# Altium schematic sheet 2228_Recepteur_Alimentation.SchDoc
size A4; Author: Miguel Santos; Organization: ETML-ES; Address1: Avenue Recordon 1; Address2: 1004 Lausanne; Address3: Switzerland; Revision: B; SheetNumber: 1; SheetTotal: 3; Version: 1.0
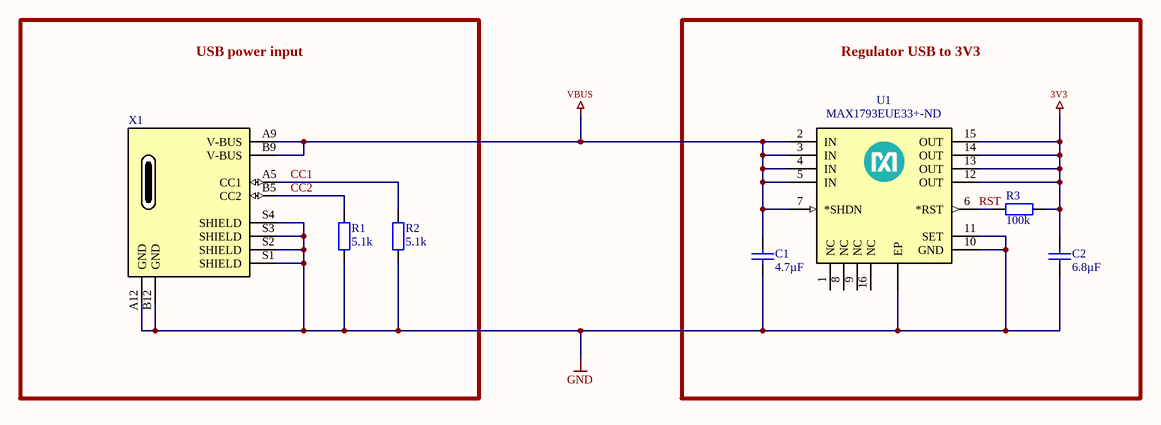
[diagram p0: 2228_Recepteur_Alimentation.SchDoc]

## Parts
C1  value 4.7µF  [CAP_0805]  (hidden comment: CAP_SMD)
C2  value 6.8µF  [CAP_0805]  (hidden comment: CAP_SMD)
R1  value 5.1k  [RES_0805]  (hidden comment: RES_SMD)
R2  value 5.1k  [RES_0805]  (hidden comment: RES_SMD)
R3  value 100k  [RES_0805]  (hidden comment: RES_SMD)
U1  Supplier Part Number 1: MAX1793EUE33+-ND  [SOP65P638X110-17N]  (hidden comment: MAX1793EUE33+)
X1  UJC-HP-3-SMT-TR  [CUI_UJC-HP-3-SMT-TR]  (value not drawn)

## Blocks framed on the sheet
USB power input: R1 R2 X1
Regulator USB to 3V3: C1 C2 R3 U1

## Nets
3V3: C2.2 R3.2 U1.12(OUT) U1.13(OUT) U1.14(OUT) U1.15(OUT)
GND: C1.1 C2.1 R1.1 R2.1 U1.0(EP) U1.10(GND) U1.11(SET) X1.A12(GND) X1.B12(GND) X1.S1(SHIELD) X1.S2(SHIELD) X1.S3(SHIELD) X1.S4(SHIELD)
VBUS: C1.2 U1.2(IN) U1.3(IN) U1.4(IN) U1.5(IN) U1.7(*SHDN) X1.A9(V-BUS) X1.B9(V-BUS)
CC1: R2.2 X1.A5(CC1)
CC2: R1.2 X1.B5(CC2)
RST: R3.1 U1.6(*RST)

Not connected (* = marked no-connect by the designer): U1 1(NC) 8(NC) 9(NC) 16(NC)

## Notes on the sheet
- Fichier :
- a
- Date :
- Heure :
- Version :
- Auteur :
- Modif.
- b
- c
- d
- Projet :
- No :
- Nb feuilles
- Feuille n°
- Chemin :

## Library data of the parts
C1 C2 = CAP_SMD: Ceramic capacitor; Manufacturer: *; Manufacturer_Number: *
U1 = MAX1793: Supplier 1: Digi-Key
X1 = USB-C_CUI: Type C, 3 A, Right Angle, Surface Mount (SMT), Power-Only USB Receptacle; Manufacturer: CUI Devices; Manufacturer_Number: UJC-HP-3-SMT-TR
R1-R3 = RES_SMD: Manufacturer: *; Manufacturer_Number: *